# EAGLE schematic simple_record (EAGLE 6.6.0)
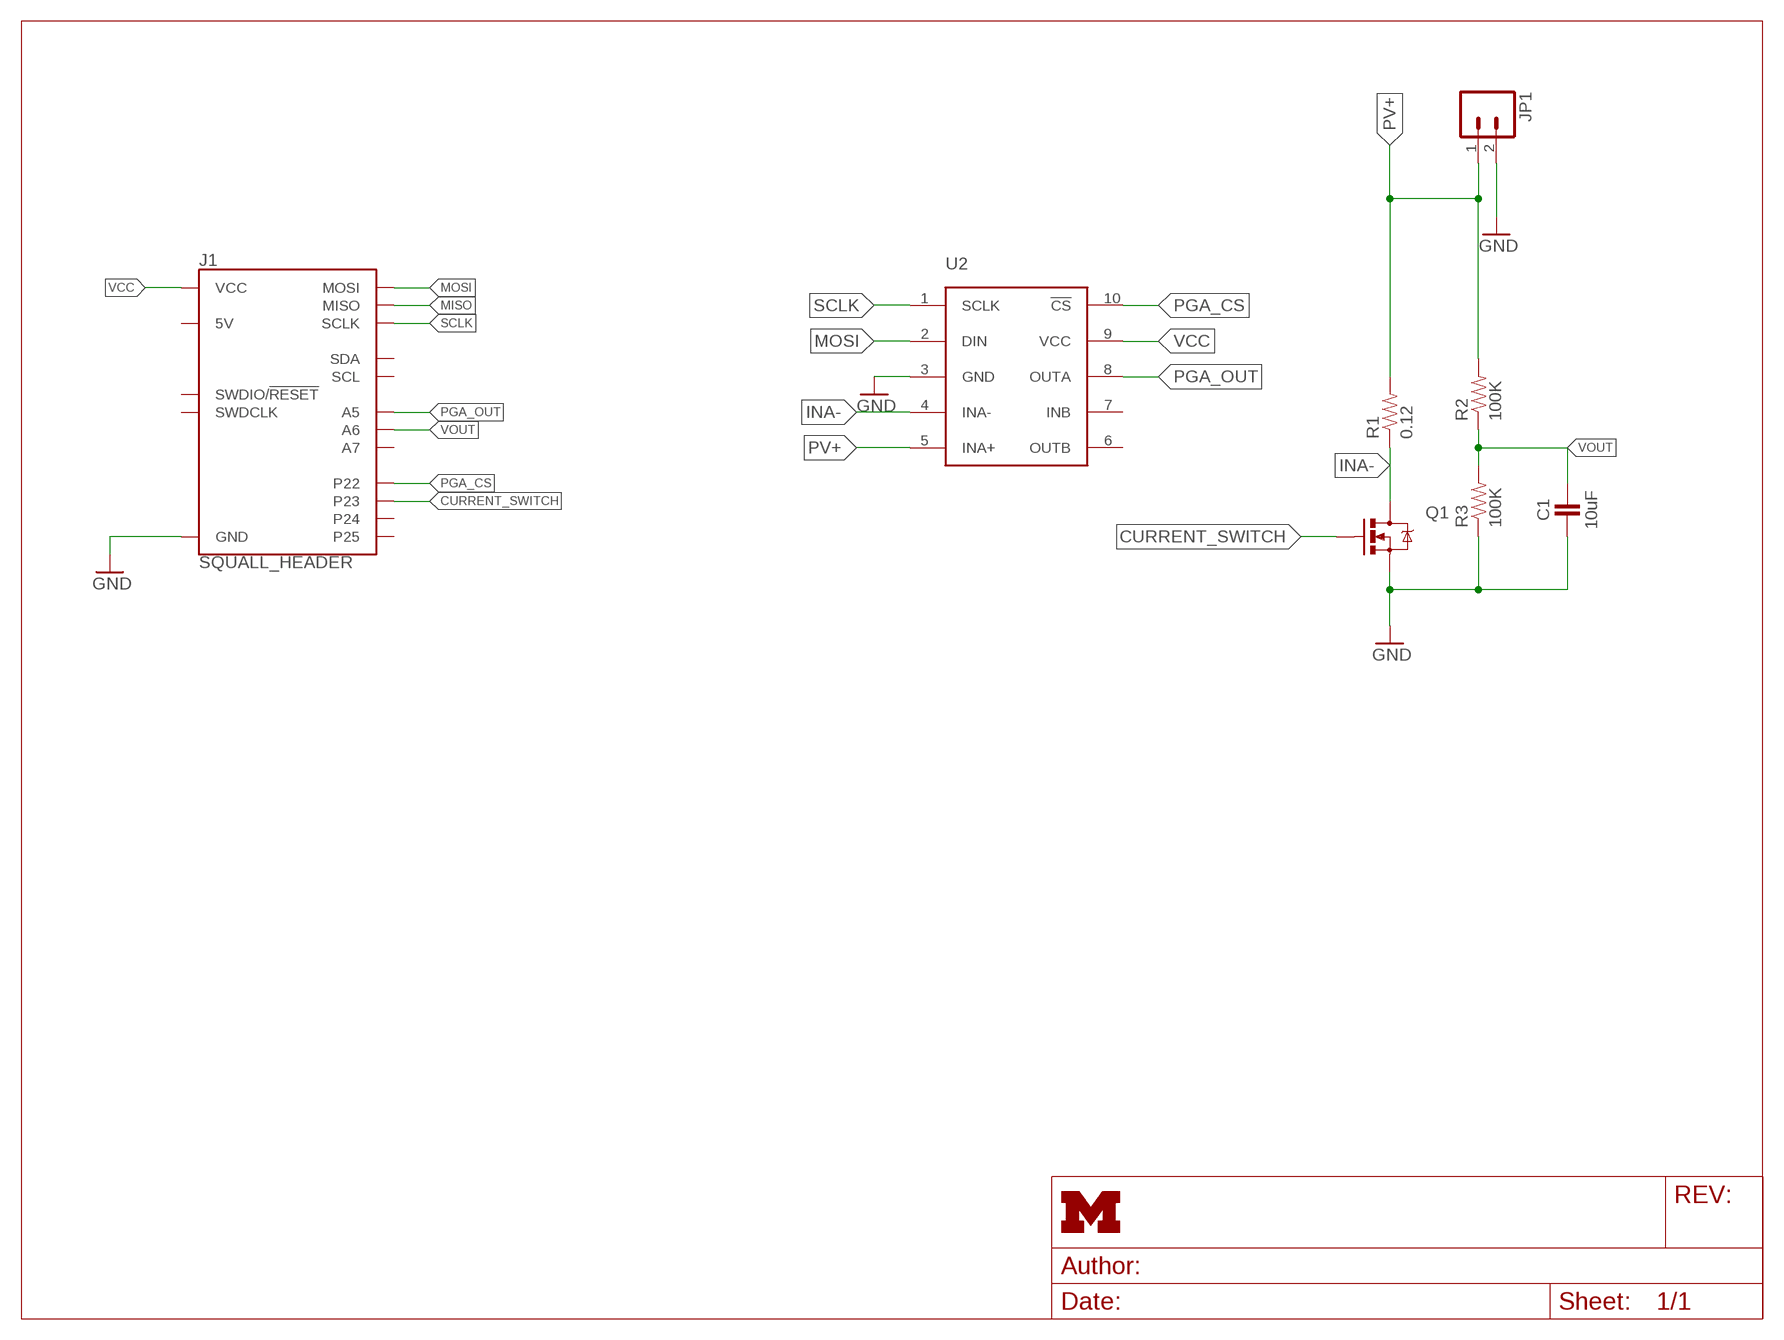
[diagram p0: schematic, sheet 1]
FRAME1 (LETTER_L): HEIGHT: 8.5in; WIDTH: 11in

## Parts
C1  10uF  CAPACITOR  [0402_CAP]
J1  SQUALL_HEADER  [SQUALL_HEADER]
JP1  M02PTH  [1X02]
Q1  MOSFET-NCHANNELSMD  [SOT23-3]
R1  0.12  RESISTOR  [0603-RES]
R2  100K  RESISTOR  [0603-RES]
R3  100K  RESISTOR  [0603-RES]
U2  MAX9939  [UMAX10]

## Nets
CURRENT_SWITCH: J1.A4(P23) Q1.1(G)
GND: C1.2 J1.A9(GND) J1.A10(GND) JP1.2 Q1.2(S) R3.1 U2.3(GND)
INA-: Q1.3(D) R1.1 U2.4(INA-)
MISO: J1.B8(MISO)
MOSI: J1.B6(MOSI) U2.2(DIN)
PGA_CS: J1.A2(P22) U2.10(!CS)
PGA_OUT: J1.B9(A5) U2.8(OUTA)
PV+: JP1.1 R1.2 R2.2 U2.5(INA+)
SCLK: J1.B10(SCLK) U2.1(SCLK)
VCC: J1.A1(VCC) J1.A3(VCC) U2.9(VCC)
VOUT: C1.1 J1.B7(A6) R2.1 R3.2
Unconnected: J1.A5(5V) J1.A6(P24) J1.A7(5V) J1.A8(P25) J1.B1(SDA) J1.B2(SWDCLK) J1.B3(SCL) J1.B4(SWDIO/!RESET) J1.B5(A7) U2.6(OUTB) U2.7(INB)

## Library data of the parts
C1 = passives:CAPACITOR: 0402 Capacitor
J1 = squall:SQUALL_HEADER: Header for a sensor board on top of the Squall BLE tag board. Requires two DF40C-10DS-0.4V(51).; DIGIKEY: H11617CT-ND
JP1 = SparkFun-Connectors:M02: Header 2 Standard 2-pin 0.1" header. Use with straight break away headers (SKU : PRT-00116), right angle break away headers (PRT-00553), swiss pins (PRT-00743), machine pins (PRT-00117), and female headers (PRT-00115). Molex polarized connector foot print use with SKU : PRT-08233 with associated crimp pins and housings.
Q1 = fets:MOSFET-NCHANNEL: Generic NMOS footprint
R1-R3 = passives:RESISTOR: Resistor Basic schematic elements and footprints for 0603, 1206, and PTH resistors.
U2 = chips:MAX9939: spi programmable differential amplifier; DIGIKEY: MAX9939AUB+-ND